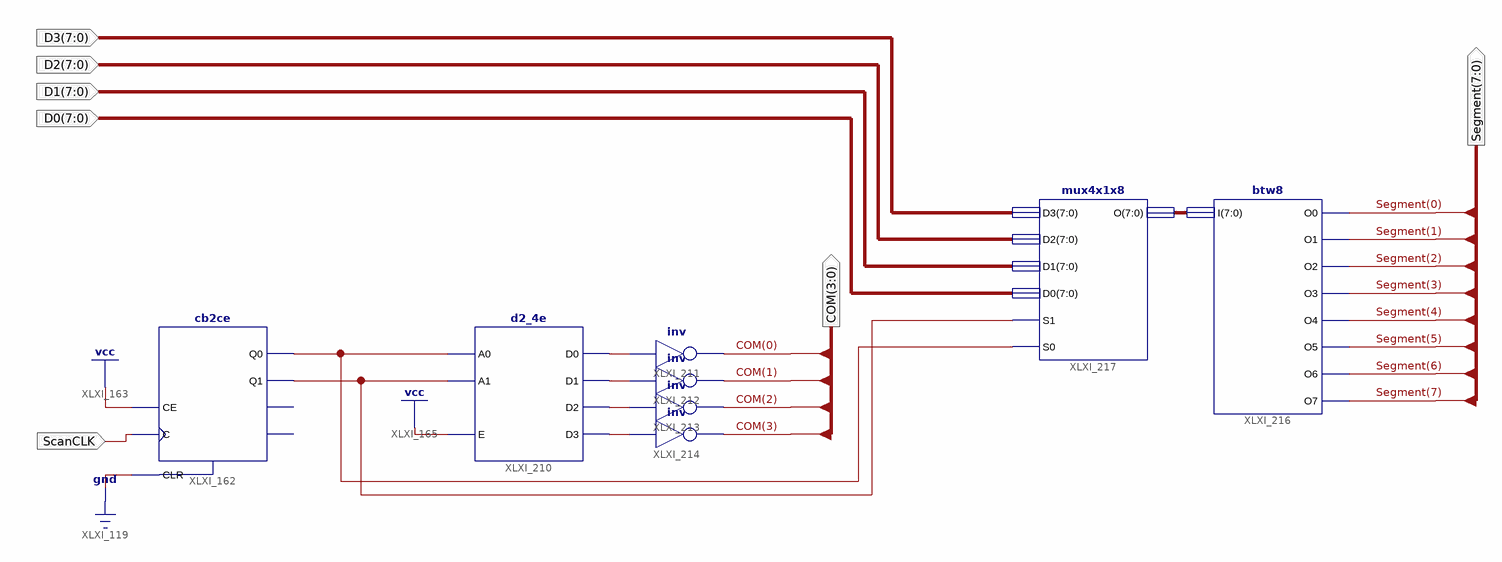
[diagram p0: schematic sheet 1]
// Xilinx ISE schematic ssd4d_raw.sch (spartan6) as structural Verilog: 8 symbols, 7 ports
module ssd4d_raw (
  input  ScanCLK,
  input  [7:0] D3,
  input  [7:0] D2,
  input  [7:0] D1,
  input  [7:0] D0,
  output [7:0] Segment,
  output [3:0] COM
);

  wire XLXN_236, XLXN_237, XLXN_238, XLXN_239, XLXN_276, XLXN_280;
  wire [7:0] XLXN_272;

  btw8 XLXI_216 (
    .I(XLXN_272), .O0(Segment[0]), .O1(Segment[1]), .O2(Segment[2]), .O3(Segment[3]), .O4(Segment[4]),
    .O5(Segment[5]), .O6(Segment[6]), .O7(Segment[7]));
  mux4x1x8 XLXI_217 (.D3(D3), .D2(D2), .D1(D1), .D0(D0), .S1(XLXN_280), .S0(XLXN_276), .O(XLXN_272));
  not XLXI_214 (COM[3], XLXN_239);
  not XLXI_213 (COM[2], XLXN_238);
  not XLXI_212 (COM[1], XLXN_237);
  not XLXI_211 (COM[0], XLXN_236);
  d2_4e XLXI_210 (.A0(XLXN_276), .A1(XLXN_280), .E(1'b1), .D0(XLXN_236), .D1(XLXN_237), .D2(XLXN_238), .D3(XLXN_239));
  cb2ce XLXI_162 (.C(ScanCLK), .CE(1'b1), .CLR(1'b0), .Q0(XLXN_276), .Q1(XLXN_280));  // open: CEO, TC
endmodule
